# EAGLE schematic DigiSpark_LED_button_cycler (EAGLE 6.5.0)
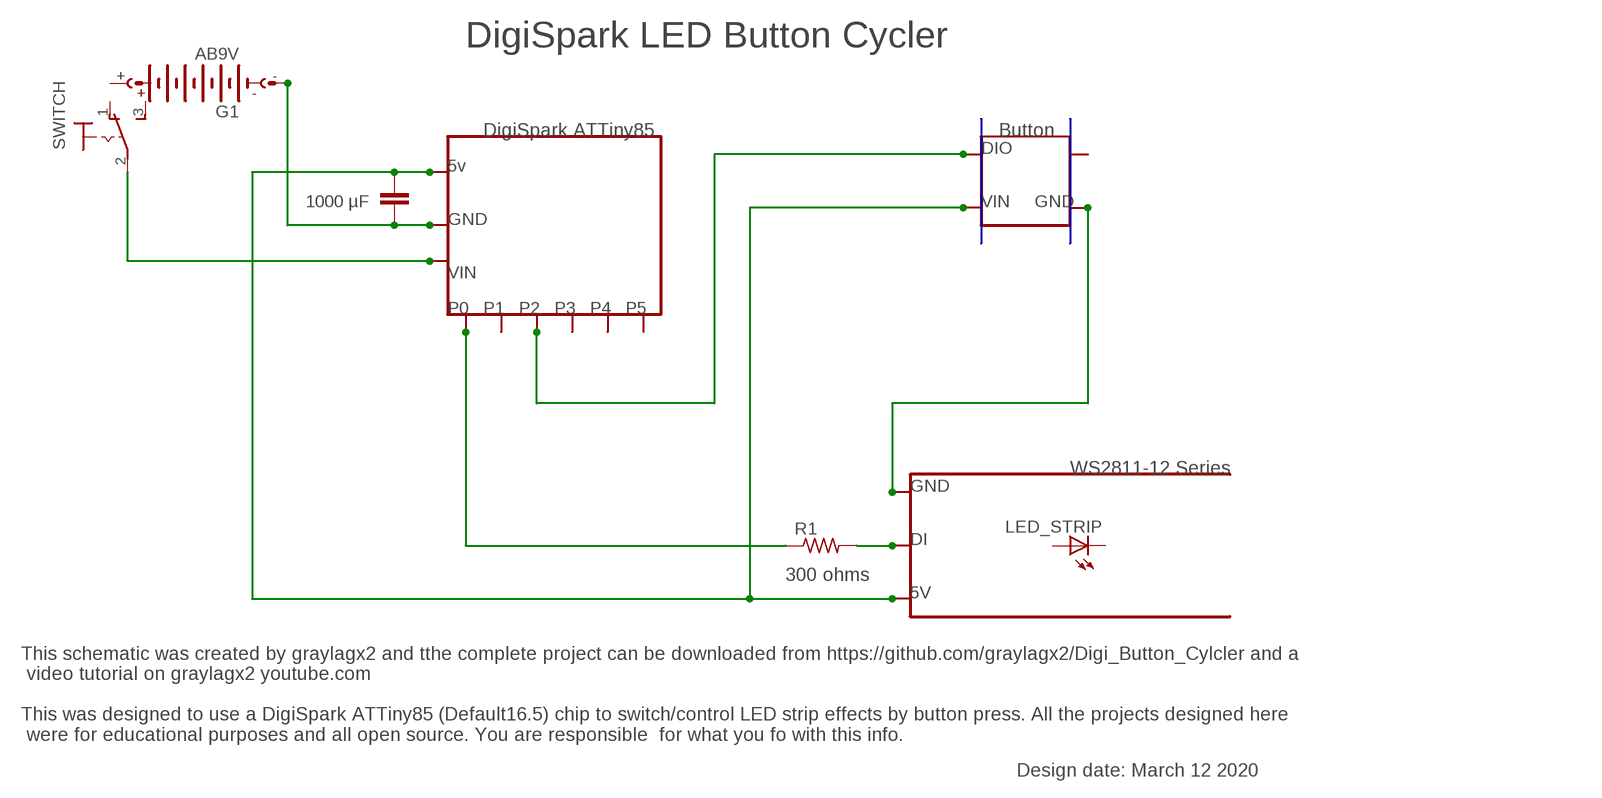
[diagram p0: schematic, sheet 1]

## Parts
G1  AB9V  [AB9V]
LED_STRIP  LZ1-00WW05  [LZ1-00WW03]
R1  R-US_0207/12  [0207/12]
SWITCH  320-916  [320-916]

## Nets
N$3: SWITCH.2(P)
N$5: R1.1
N$8: R1.2
Unconnected: G1.+ G1.- LED_STRIP.1(C) LED_STRIP.2(A) LED_STRIP.3(A) LED_STRIP.4(C) LED_STRIP.5(A) SWITCH.1(O) SWITCH.3(S)

## Buses
B$1
B$2

## Notes on the sheet
- DigiSpark LED Button Cycler
- DigiSpark ATTiny85 | Button
- DIO
- 5v
- 1000 µF | VIN | GND
- GND
- VIN
- P0 | P1 | P2 | P3 | P4 | P5
- WS2811-12 Series
- GND
- DI
- 300 ohms
- 5V
- This schematic was created by graylagx2 and tthe complete project can be downloaded from https://github.com/graylagx2/Digi_Button_Cylcler and a
   video tutorial on graylagx2 youtube.com
  
  This was designed to use a DigiSpark ATTiny85 (Default16.5) chip to switch/control LED strip effects by button press. All the projects designed here
   were for educational purposes and all open source. You are responsible  for what you fo with this info.
- Design date: March 12 2020

## Library data of the parts
G1 = battery:AB9V: 9-V BATTERY CLIP
LED_STRIP = led:LZ1-00WW05: High Luminous Efficacy 5W Warm White LED Source: http://www.ledengin.com/products/5wLZ/LZ1-00WW05.pdf
R1 = resistor:R-US_: RESISTOR, American symbol
SWITCH = switch:320-916: TOGGLE SWITCH distributor RS Components